# Altium project PowerBoard.PrjPcb
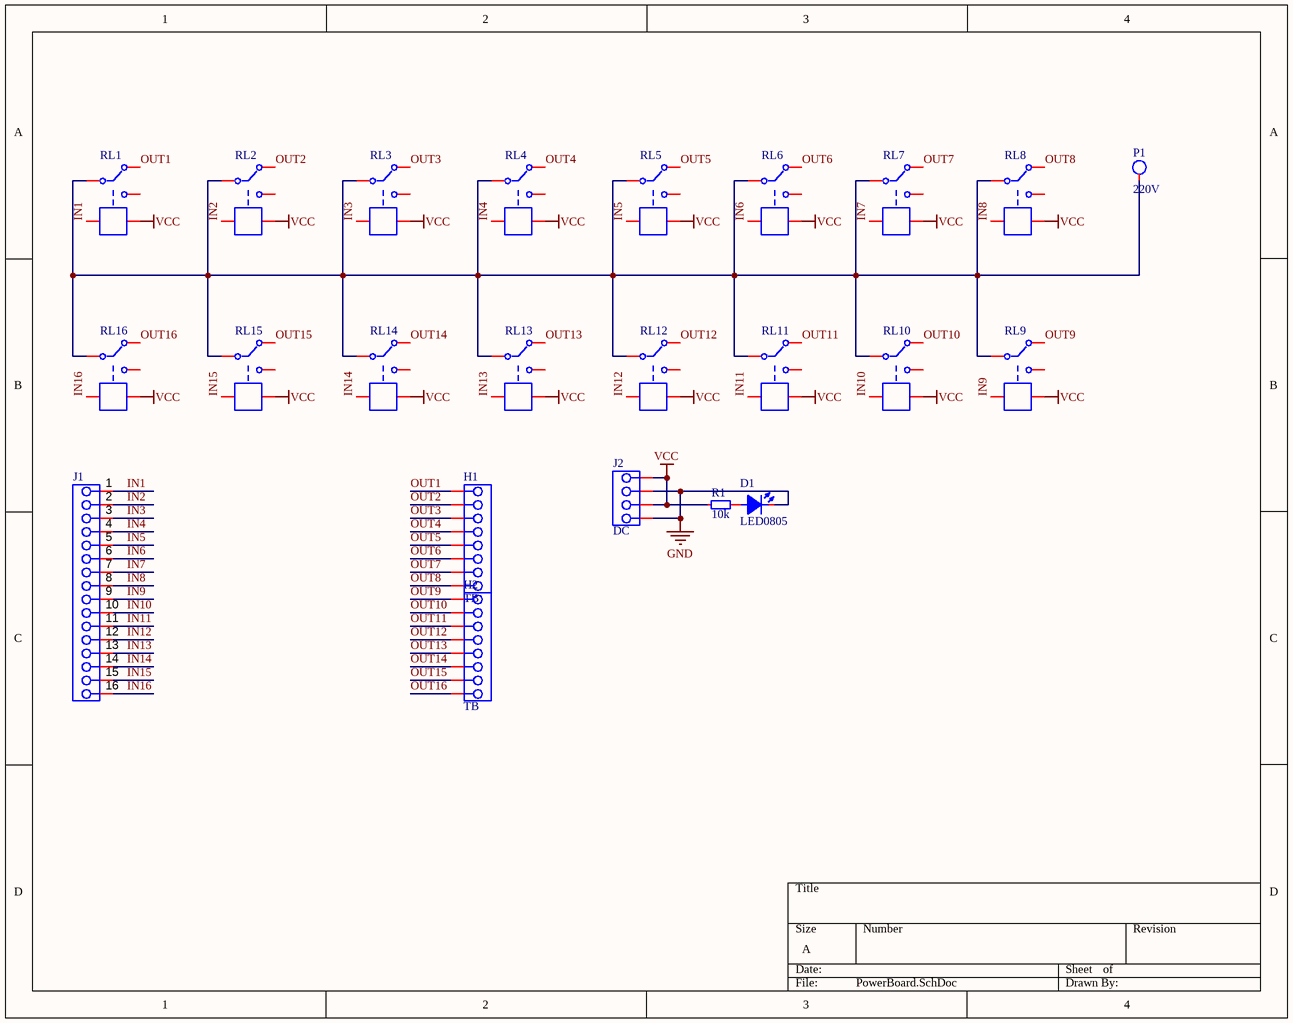
[diagram p0: PowerBoard.SchDoc]
1 sheet, 23 parts. Net scope: global (net labels, ports and power ports of the same name join across sheets).
Board file: PowerBoard.PcbDoc

## Sheet PowerBoard.SchDoc
size A; SheetNumber: 1; SheetTotal: 1

### Parts
D1  LED0805  [L0805RED]
H1  TB  [TERMINAL-BLOCK-7.62MM -08PIN]
H2  TB  [TERMINAL-BLOCK-7.62MM -08PIN]
J1  HEADER-FEMALE-2.54MM  [HEADER-FEMALE-16PINS-2.54MM]  (value not drawn)
J2  DC  [DG350-3.5-04P-12-00AH]
P1  220V  [SolderPoint]
R1  10k  [R0805]
RL1  Relay-SONGLE-SRD-05VDC  [RELAY-SONGLE-SRD-05VDC_BLUE]  (value not drawn)
RL2  Relay-SONGLE-SRD-05VDC  [RELAY-SONGLE-SRD-05VDC_BLUE]  (value not drawn)
RL3  Relay-SONGLE-SRD-05VDC  [RELAY-SONGLE-SRD-05VDC_BLUE]  (value not drawn)
RL4  Relay-SONGLE-SRD-05VDC  [RELAY-SONGLE-SRD-05VDC_BLUE]  (value not drawn)
RL5  Relay-SONGLE-SRD-05VDC  [RELAY-SONGLE-SRD-05VDC_BLUE]  (value not drawn)
RL6  Relay-SONGLE-SRD-05VDC  [RELAY-SONGLE-SRD-05VDC_BLUE]  (value not drawn)
RL7  Relay-SONGLE-SRD-05VDC  [RELAY-SONGLE-SRD-05VDC_BLUE]  (value not drawn)
RL8  Relay-SONGLE-SRD-05VDC  [RELAY-SONGLE-SRD-05VDC_BLUE]  (value not drawn)
RL9  Relay-SONGLE-SRD-05VDC  [RELAY-SONGLE-SRD-05VDC_BLUE]  (value not drawn)
RL10  Relay-SONGLE-SRD-05VDC  [RELAY-SONGLE-SRD-05VDC_BLUE]  (value not drawn)
RL11  Relay-SONGLE-SRD-05VDC  [RELAY-SONGLE-SRD-05VDC_BLUE]  (value not drawn)
RL12  Relay-SONGLE-SRD-05VDC  [RELAY-SONGLE-SRD-05VDC_BLUE]  (value not drawn)
RL13  Relay-SONGLE-SRD-05VDC  [RELAY-SONGLE-SRD-05VDC_BLUE]  (value not drawn)
RL14  Relay-SONGLE-SRD-05VDC  [RELAY-SONGLE-SRD-05VDC_BLUE]  (value not drawn)
RL15  Relay-SONGLE-SRD-05VDC  [RELAY-SONGLE-SRD-05VDC_BLUE]  (value not drawn)
RL16  Relay-SONGLE-SRD-05VDC  [RELAY-SONGLE-SRD-05VDC_BLUE]  (value not drawn)

### Nets
GND: D1.2(K) J2.2 J2.4
VCC: J2.1 J2.3 R1.1 RL1.3 RL2.3 RL3.3 RL4.3 RL5.3 RL6.3 RL7.3 RL8.3 RL9.3 RL10.3 RL11.3 RL12.3 RL13.3 RL14.3 RL15.3 RL16.3
IN1: J1.1 RL1.1
IN2: J1.2 RL2.1
IN3: J1.3 RL3.1
IN4: J1.4 RL4.1
IN5: J1.5 RL5.1
IN6: J1.6 RL6.1
IN7: J1.7 RL7.1
IN8: J1.8 RL8.1
IN9: J1.9 RL9.1
IN10: J1.10 RL10.1
IN11: J1.11 RL11.1
IN12: J1.12 RL12.1
IN13: J1.13 RL13.1
IN14: J1.14 RL14.1
IN15: J1.15 RL15.1
IN16: J1.16 RL16.1
OUT1: H1.8 RL1.5
OUT2: H1.7 RL2.5
OUT3: H1.6 RL3.5
OUT4: H1.5 RL4.5
OUT5: H1.4 RL5.5
OUT6: H1.3 RL6.5
OUT7: H1.2 RL7.5
OUT8: H1.1 RL8.5
OUT9: H2.8 RL9.5
OUT10: H2.7 RL10.5
OUT11: H2.6 RL11.5
OUT12: H2.5 RL12.5
OUT13: H2.4 RL13.5
OUT14: H2.3 RL14.5
OUT15: H2.2 RL15.5
OUT16: H2.1 RL16.5
NetD1_1: D1.1(A) R1.2
NetP1_1: P1.1 RL1.2 RL2.2 RL3.2 RL4.2 RL5.2 RL6.2 RL7.2 RL8.2 RL9.2 RL10.2 RL11.2 RL12.2 RL13.2 RL14.2 RL15.2 RL16.2

Not connected (* = marked no-connect by the designer): RL1 4; RL2 4; RL3 4; RL4 4; RL5 4; RL6 4; RL7 4; RL8 4; RL9 4; RL10 4; RL11 4; RL12 4; RL13 4; RL14 4; RL15 4; RL16 4

### Library data of the parts
H1 H2 = TERMINAL-BLOCK-7.62MM-08PIN
J1 = HEADER-FEMALE-16PINS-2.54MM
J2 = DGxxx_04P
P1 = SolderPoint
R1 = Resistors-SMD